# Altium project Cavro Ribbon Interface.PrjPcb
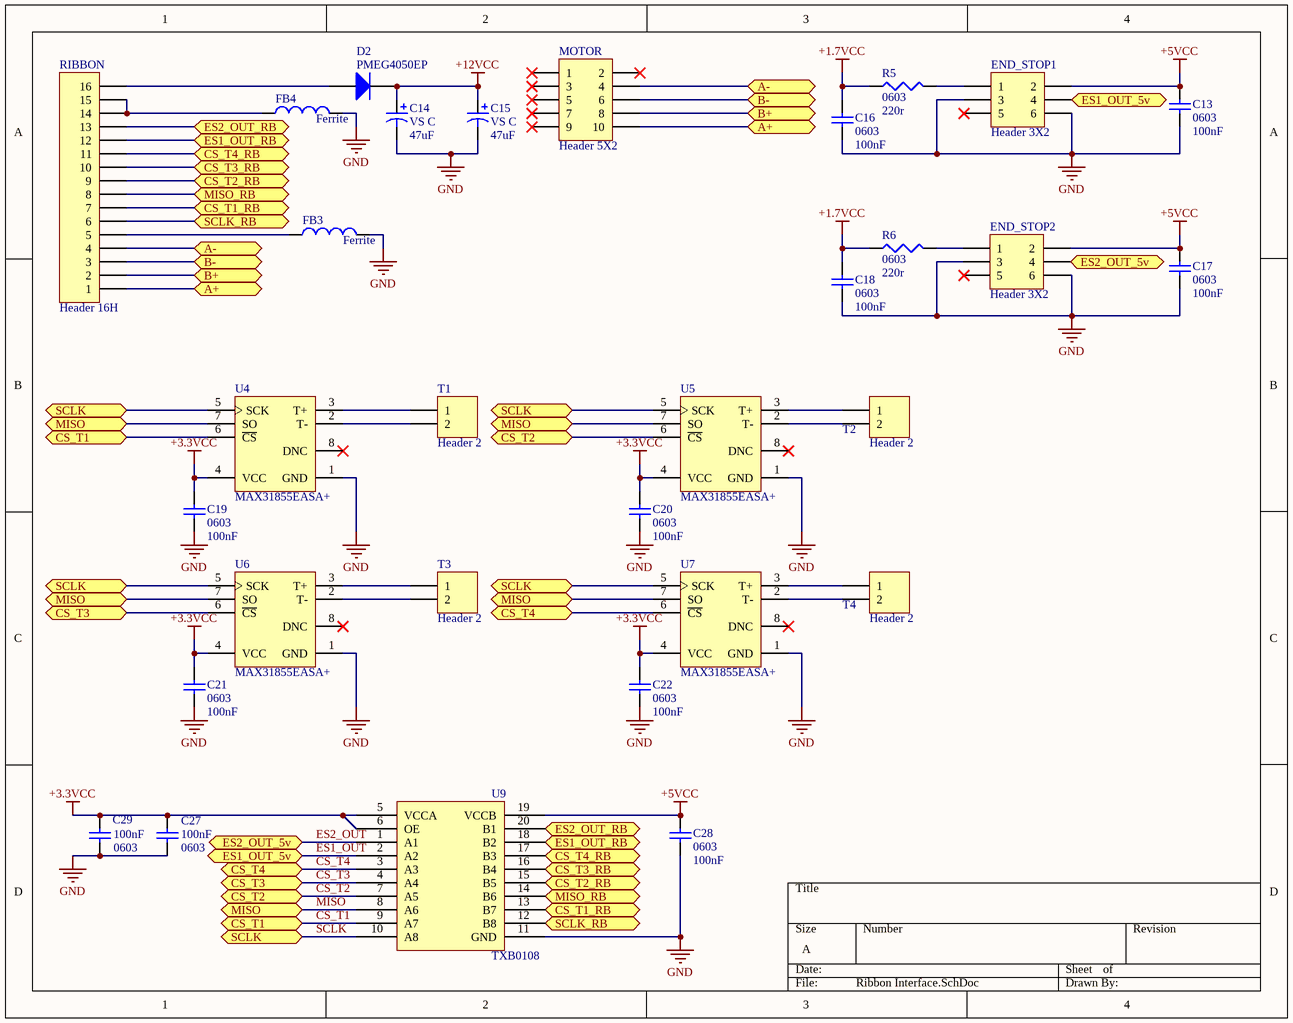
[diagram p0: Ribbon Interface.SchDoc]
2 sheets, 49 parts. Net scope: flat (ports and power ports of the same name join across sheets).
Board file: Cavro Ribbon Interface Top.PcbDoc
Sheets:
  Ribbon Interface.SchDoc
  Power.SchDoc

## Sheet Ribbon Interface.SchDoc
size A

### Parts
C13  0603  value 100nF  [1608[0603]]
C14  VS C  value 47uF  [Panasonic VS C]
C15  VS C  value 47uF  [Panasonic VS C]
C16  0603  value 100nF  [1608[0603]]
C17  0603  value 100nF  [1608[0603]]
C18  0603  value 100nF  [1608[0603]]
C19  0603  value 100nF  [1608[0603]]
C20  0603  value 100nF  [1608[0603]]
C21  0603  value 100nF  [1608[0603]]
C22  0603  value 100nF  [1608[0603]]
C27  0603  value 100nF  [1608[0603]]
C28  0603  value 100nF  [1608[0603]]
C29  0603  value 100nF  [1608[0603]]
D2  PMEG4050EP  [PMEG4050EP]
END_STOP1  Header 3X2  [HDR2X3]
END_STOP2  Header 3X2  [HDR2X3]
FB3  Ferrite  [SM 0805 - gap trimmed]
FB4  Ferrite  [SM 0805 - gap trimmed]
MOTOR  Header 5X2  [HDR2X5]
R5  0603  value 220r  [J1-0603]
R6  0603  value 220r  [J1-0603]
RIBBON  Header 16H  [HDR1X16H]
T1  Header 2  [HDR1X2]
T2  Header 2  [HDR1X2]
T3  Header 2  [HDR1X2]
T4  Header 2  [HDR1X2]
U4  MAX31855EASA+  [MAXM-S8+4_N]
U5  MAX31855EASA+  [MAXM-S8+4_N]
U6  MAX31855EASA+  [MAXM-S8+4_N]
U7  MAX31855EASA+  [MAXM-S8+4_N]
U9  TXB0108  [TXB0108]

### Ports
A+, A-, B+, B-, CS_T1 (bidir), CS_T1_RB, CS_T2 (bidir), CS_T2_RB, CS_T3 (bidir), CS_T3_RB, CS_T4 (bidir), CS_T4_RB, ES1_OUT_5v, ES1_OUT_RB, ES2_OUT_5v, ES2_OUT_RB, MISO (bidir), MISO_RB, SCLK (bidir), SCLK_RB

### Nets
+1.7VCC: C16.2 C18.2 R5.1 R6.1
+3.3VCC: C19.2 C20.2 C21.2 C22.2 C27.2 C29.2 U4.4(VCC) U5.4(VCC) U6.4(VCC) U7.4(VCC) U9.5(VCCA) U9.6(OE)
+5VCC: C13.2 C17.2 C28.2 END_STOP1.2 END_STOP2.2 U9.19(VCCB)
+12VCC: C14.1 C15.1 D2.1(A)
GND: C13.1 C14.2 C15.2 C16.1 C17.1 C18.1 C19.1 C20.1 C21.1 C22.1 C27.1 C28.1 C29.1 END_STOP1.3 END_STOP1.6 END_STOP2.3 END_STOP2.6 FB3.2 FB4.2 U4.1(GND) U5.1(GND) U6.1(GND) U7.1(GND) U9.11(GND)
CS_T1: U4.6(~{CS}) U9.9(A7) ; port CS_T1
CS_T2: U5.6(~{CS}) U9.7(A5) ; port CS_T2
CS_T3: U6.6(~{CS}) U9.4(A4) ; port CS_T3
CS_T4: U7.6(~{CS}) U9.3(A3) ; port CS_T4
ES1_OUT: END_STOP1.4 U9.2(A2) ; port ES1_OUT_5v
ES2_OUT: END_STOP2.4 U9.1(A1) ; port ES2_OUT_5v
MISO: U4.7(SO) U5.7(SO) U6.7(SO) U7.7(SO) U9.8(A6) ; port MISO
SCLK: U4.5(SCK) U5.5(SCK) U6.5(SCK) U7.5(SCK) U9.10(A8) ; port SCLK
NetD2_2: D2.2(K) RIBBON.16
NetEND_STOP1_1: END_STOP1.1 R5.2
NetEND_STOP2_1: END_STOP2.1 R6.2
NetFB3_1: FB3.1 RIBBON.5
NetFB4_1: FB4.1 RIBBON.14 RIBBON.15
NetMOTOR_4: MOTOR.4 RIBBON.4 ; port A-
NetMOTOR_6: MOTOR.6 RIBBON.3 ; port B-
NetMOTOR_8: MOTOR.8 RIBBON.2 ; port B+
NetMOTOR_10: MOTOR.10 RIBBON.1 ; port A+
NetRIBBON_6: RIBBON.6 U9.12(B8) ; port SCLK_RB
NetRIBBON_7: RIBBON.7 U9.13(B7) ; port CS_T1_RB
NetRIBBON_8: RIBBON.8 U9.14(B6) ; port MISO_RB
NetRIBBON_9: RIBBON.9 U9.15(B5) ; port CS_T2_RB
NetRIBBON_10: RIBBON.10 U9.16(B4) ; port CS_T3_RB
NetRIBBON_11: RIBBON.11 U9.17(B3) ; port CS_T4_RB
NetRIBBON_12: RIBBON.12 U9.18(B2) ; port ES1_OUT_RB
NetRIBBON_13: RIBBON.13 U9.20(B1) ; port ES2_OUT_RB
NetT1_1: T1.1 U4.3(T+)
NetT1_2: T1.2 U4.2(T-)
NetT2_1: T2.1 U5.3(T+)
NetT2_2: T2.2 U5.2(T-)
NetT3_1: T3.1 U6.3(T+)
NetT3_2: T3.2 U6.2(T-)
NetT4_1: T4.1 U7.3(T+)
NetT4_2: T4.2 U7.2(T-)

Not connected (* = marked no-connect by the designer): END_STOP1 5*; END_STOP2 5; MOTOR 1* 2* 3* 5* 7* 9*; U4 8(DNC)*; U5 8(DNC)*; U6 8(DNC)*; U7 8(DNC)*

### Library data of the parts
C13 C16-C22 C27-C29 = Cap Semi: Capacitor (Semiconductor SIM Model); Published: 8-Jun-2000; LatestRevisionDate: 29-May-2009; LatestRevisionNote: IPC-7351 Footprint Added.; PackageReference: C1206; Publisher: Altium Limited; PackageDescription: Chip Capacitor
C14 C15 = Cap Pol1: Polarized Capacitor (Radial); Published: 8-Jun-2000; LatestRevisionDate: 17-Jul-2002; LatestRevisionNote: Re-released for DXP Platform.; PackageReference: RB7.6-15; Publisher: Altium Limited; PackageDescription: Polarized Capacitor (Radial); 2 Leads
D2 = Diode: Default Diode; Published: 8-Jun-2000; LatestRevisionDate: 17-Jul-2002; LatestRevisionNote: Re-released for DXP Platform.; PackageVersion: Sep-1996; PackageReference: SMC; Publisher: Altium Limited; PackageDescription: DO-214-AB/SMC; 2 C-Bend Leads; Body 7.9 x 5.9 mm, inc. leads (LxW); Code_JEDEC: DO-214-AB
END_STOP1 END_STOP2 = Header 3X2: Header, 3-Pin, Dual row; LatestRevisionDate: 17-Jul-2002; LatestRevisionNote: Re-released for DXP Platform.; Publisher: Altium Limited
FB3 FB4 = Inductor: Code_IEC: 1005; Published: 8-Jun-2000; LatestRevisionDate: 17-Jul-2002; LatestRevisionNote: Re-released for DXP Platform.; PackageReference: 0402-A; Publisher: Altium Limited; Code_JEITA: 0402
MOTOR = Header 5X2: Header, 5-Pin, Dual row; LatestRevisionDate: 17-Jul-2002; LatestRevisionNote: Re-released for DXP Platform.; Publisher: Altium Limited
R5 R6 = Res3: Resistor; Published: 8-Jun-2000; LatestRevisionDate: 29-May-2009; LatestRevisionNote: IPC-7351 Footprint Added.; PackageReference: J1-0603; Publisher: Altium Limited; PackageDescription: Chip Resistor
RIBBON = Header 16H: Header, 16-Pin, Right Angle; LatestRevisionDate: 17-Jul-2002; LatestRevisionNote: Re-released for DXP Platform.; Publisher: Altium Limited
T1-T4 = Header 2: Header, 2-Pin; LatestRevisionDate: 17-Jul-2002; LatestRevisionNote: Re-released for DXP Platform.; Publisher: Altium Limited
U4-U7 = MAX31855EASA+: Cold Junction Compensated Thermocouple to Digital Converter, 14 Bits Temperature Resolution, -40 to 125 degC, 8-Pin SOIC (S8+4), Pb-Free; Functions: Thermocouple-to-Digital Converter; Interface: SPI; Parasite Pwr.: No; DatasheetVersion: Rev. 2; PackageVersion: Rev. D, 10/2012; PackageReference: S8+4; PackageDescription: 8-Pin Small-Outline IC, Narrow, Body 3.9 x 4.9 mm, Pitch 1.27 mm; Supplier 1: Digi-Key; Supplier Part Number 1: MAX31855EASA+-ND; Supplier 2: Mouser; Supplier Part Number 2: 700-MAX31855EASA+; Generic Part Number: MAX31855; Mounting Technology: Surface Mount; Code_JEDEC: MS-012; PartNumber: MAX31855EASA+; ComponentLink1Description: Manufacturer URL; ComponentLink1URL: http://www.maximintegrated.com/; ComponentLink2Description: Datasheet; ComponentLink2URL: http://datasheets.maximintegrated.com/en/ds/MAX31855.pdf; ComponentLink3Description: Package Specification; ComponentLink3URL: http://pdfserv.maximintegrated.com/package_dwgs/21-0041.PDF
U9 = TXB0108: Ti TXB0108 Bidirectional Level Translator

## Sheet Power.SchDoc
size A
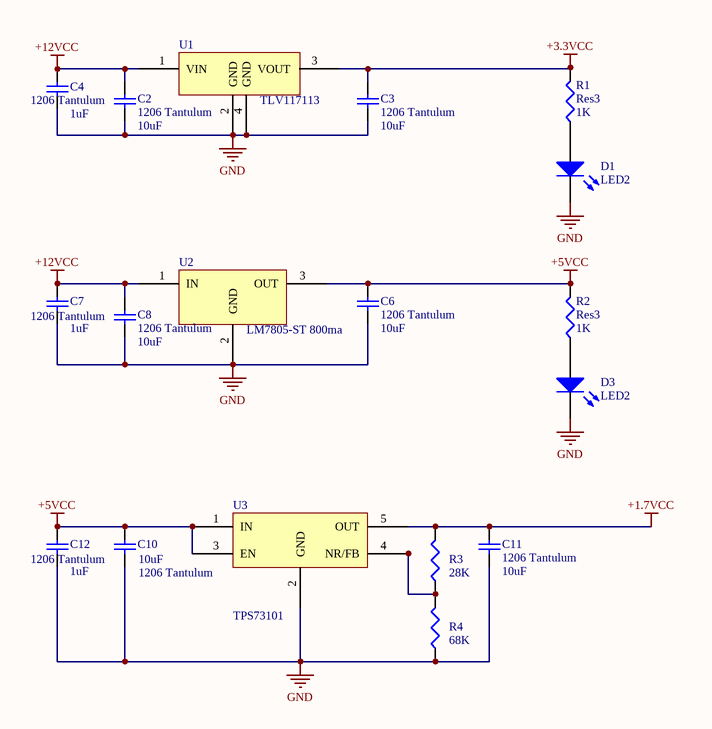
[diagram p1: Power.SchDoc]

### Parts
C2  1206 Tantulum  value 10uF  [C1206]
C3  1206 Tantulum  value 10uF  [C1206]
C4  1206 Tantulum  value 1uF  [C1206]
C6  1206 Tantulum  value 10uF  [C1206]
C7  1206 Tantulum  value 1uF  [C1206]
C8  1206 Tantulum  value 10uF  [C1206]
C10  1206 Tantulum  value 10uF  [C1206]
C11  1206 Tantulum  value 10uF  [C1206]
C12  1206 Tantulum  value 1uF  [C1206]
D1  LED2  [SM 0805 polarized]
D3  LED2  [SM 0805 polarized]
R1  Res3  value 1K  [SM 0805 - gap trimmed]
R2  Res3  value 1K  [SM 0805 - gap trimmed]
R3  value 28K  [SM 0805 - gap trimmed]  (hidden comment: Res3)
R4  value 68K  [SM 0805 - gap trimmed]  (hidden comment: Res3)
U1  TLV117113  [TLV117112]
U2  LM7805-ST 800ma  [DPAK-3]
U3  TPS73101  [TPS73101]

### Nets
+1.7VCC: C11.2 R3.2 U3.5(OUT)
+3.3VCC: C3.2 R1.2 U1.3(VOUT)
+5VCC: C6.2 C10.2 C12.2 R2.2 U2.3(OUT) U3.1(IN) U3.3(EN)
+12VCC: C2.2 C4.2 C7.2 C8.2 U1.1(VIN) U2.1(IN)
GND: C2.1 C3.1 C4.1 C6.1 C7.1 C8.1 C10.1 C11.1 C12.1 D1.1(A) D3.1(A) R4.1 U1.2(GND) U1.4(GND) U2.2(GND) U3.2(GND)
NetD1_2: D1.2(K) R1.1
NetD3_2: D3.2(K) R2.1
NetR3_1: R3.1 R4.2 U3.4(NR/FB)

### Library data of the parts
C2-C4 C6-C8 C10-C12 = Cap Semi: Capacitor (Semiconductor SIM Model); Published: 8-Jun-2000; LatestRevisionDate: 29-May-2009; LatestRevisionNote: IPC-7351 Footprint Added.; PackageReference: C1206; Publisher: Altium Limited; PackageDescription: Chip Capacitor
D1 D3 = LED2: Typical RED, GREEN, YELLOW, AMBER GaAs LED; Published: 8-Jun-2000; LatestRevisionDate: 17-Jul-2002; LatestRevisionNote: Re-released for DXP Platform.; PackageVersion: Feb-2002; PackageReference: 3.2X1.6X1.1; Publisher: Altium Limited; PackageDescription: SM LED; 2 Flat Leads
R1-R4 = Res3: Resistor; Published: 8-Jun-2000; LatestRevisionDate: 29-May-2009; LatestRevisionNote: IPC-7351 Footprint Added.; PackageReference: J1-0603; Publisher: Altium Limited; PackageDescription: Chip Resistor
U1 = TLV117112: Linear Regulator
U2 = LM708-ST 800ma
U3 = TPS73101: Ti TPS73101 Adjustable LDO

## Nets that join several sheets
+1.7VCC: Ribbon Interface (C16.2 C18.2 R5.1 R6.1), Power (C11.2 R3.2 U3.5)
+3.3VCC: Ribbon Interface (12 pins), Power (C3.2 R1.2 U1.3)
+5VCC: Ribbon Interface (6 pins), Power (7 pins)
+12VCC: Ribbon Interface (C14.1 C15.1 D2.1), Power (6 pins)
GND: Ribbon Interface (24 pins), Power (16 pins)